# EAGLE design WIRELESS_CHARGING_v1 (EAGLE 9.6.2)
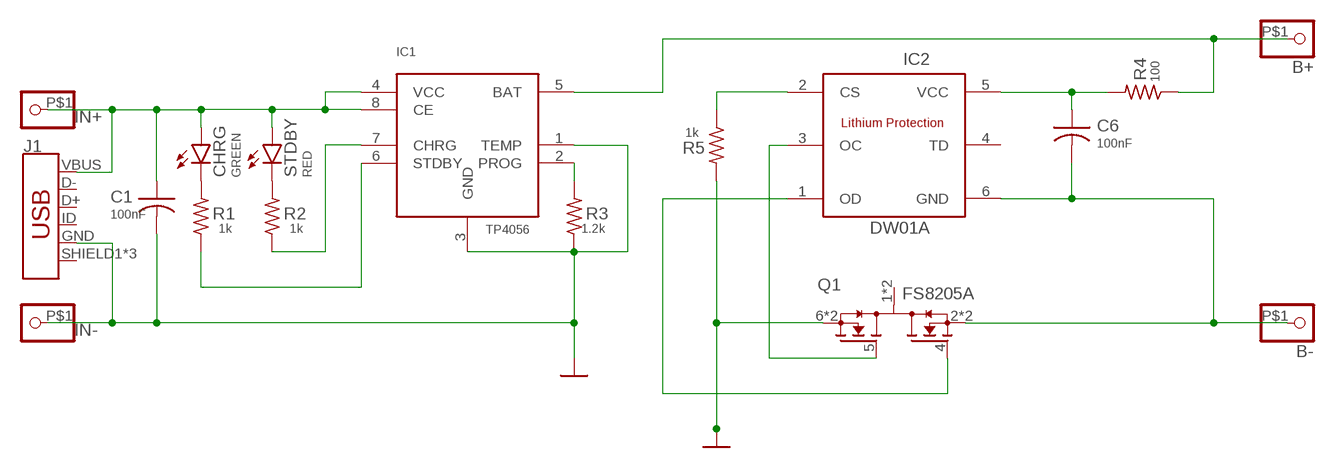
[diagram p0: schematic, sheet 1]

## Parts
B+  PINHD-1X1-BIGPOGO  [1X1-BIGPOGO]
B-  PINHD-1X1-BIGPOGO  [1X1-BIGPOGO]
C1  100nF  C-USC0805  [C0805]
C6  100nF  C-USC0805  [C0805]
CHRG  GREEN  LEDCHIP-LED0805  [CHIP-LED0805]
IC1  TP4056  [SOP-8]
IC2  DW01A  [SOT23-6]
IN+  PINHD-1X1-BIGPOGO  [1X1-BIGPOGO]
IN-  PINHD-1X1-BIGPOGO  [1X1-BIGPOGO]
J1  USB_MICRO-B_FEMALE-SMT  [USB-B-MICRO-SMD]
Q1  FS8205A  [SOP65P640X120-8N]
R1  1k  R-US_M0805  [M0805]
R2  1k  R-US_M0805  [M0805]
R3  1.2k  R-US_M0805  [M0805]
R4  100  R-US_M0805  [M0805]
R5  1k  R-US_M0805  [M0805]
STDBY  RED  LEDCHIP-LED0805  [CHIP-LED0805]

## Nets
GND: C1.2 IC1.1(TEMP) IC1.3(GND) IN-.P$1 J1.GND Q1.6(S2) Q1.7(S2) R3.1 R5.2
N$1: C1.1 CHRG.A IC1.4(VCC) IC1.8(CE) IN+.P$1 J1.VBUS STDBY.A
N$2: IC1.6(STDBY) R1.1
N$3: CHRG.C R1.2
N$4: R2.2 STDBY.C
N$5: IC1.7(CHRG) R2.1
N$6: IC1.2(PROG) R3.2
N$7: C6.1 IC2.5(VCC) R4.2
N$8: B-.P$1 C6.2 IC2.6(GND) Q1.2(S1) Q1.3(S1)
N$9: B+.P$1 IC1.5(BAT) R4.1
N$10: IC2.2(CS) R5.1
N$11: IC2.1(OD) Q1.4(G1)
N$12: IC2.3(OC) Q1.5(G2)
Unconnected: IC2.4(TD) J1.D+ J1.D- J1.ID J1.SHIELD1(SHIELD) J1.SHIELD2(SHIELD) J1.SHIELD3(SHIELD) Q1.1(D12) Q1.8(D12)

## Library data of the parts
B+ B- IN+ IN- = adafruit:PINHD-1X1: Pin header 1x1 for 0.1" spacing With round pins
C1 C6 = rcl:C-US: CAPACITOR, American symbol; SPICEPREFIX: C
CHRG STDBY = led:LED: LED OSRAM: - CHIPLED LG R971, LG N971, LY N971, LG Q971, LY Q971, LO R971, LY R971 LH N974, LH R974 LS Q976, LO Q976, LY Q976 LO Q996 - Hyper CHIPLED LW Q18S LB Q993, LB Q99A, LB R99A - SideLED LS A670, LO A670, LY A670, LG A670, LP A670 LB A673, LV A673, LT A673, LW A673 LH A674 LY A675 LS A676, LA A676, LO A676, LY A676, LW A676 LS A679, LY A679, LG A679 - Hyper Micro SIDELED® LS Y876, LA Y876, LO Y876, LY Y876 LT Y87S - SmartLED LW L88C, LW L88S LB L89C, LB L89S, LG L890 LS L89K, LO L89K, LY L89K LS L896, LA L896, LO L896, LY L896 - TOPLED LS T670, LO T670, LY T670, LG T670, LP T670 LSG T670, LSP T670, LSY T670, LOP T670, LYG T670 LG T671, LOG T671, LSG T671 LB T673, LV T673, LT T673, LW T673 LH T674 LS T676, LA T676, LO T676, LY T676, LB T676, LH T676, LSB T676, LW T676 LB T67C, LV T67C, LT T67C, LS T67K, LO T67K, LY T67K, LW E67C LS E67B, LA E67B, LO E67B, LY E67B, LB E67C, LV E67C, LT E67C LW T67C LS T679, LY T679, LG T679 LS T770, LO T770, LY T770, LG T770, LP T770 LB T773, LV T773, LT T773, LW T773 LH T774 LS E675, LA E675, LY E675, LS T675 LS T776, LA T776, LO T776, LY T776, LB T776 LHGB T686 LT T68C, LB T68C - Hyper Mini TOPLED® LB M676 - Mini TOPLED Santana® LG M470 LS M47K, LO M47K, LY M47K Source: http://www.osram.convergy.de LUXEON: - LUMILED® LXK2-PW12-R00, LXK2-PW12-S00, LXK2-PW14-U00, LXK2-PW14-V00 LXK2-PM12-R00, LXK2-PM12-S00, LXK2-PM14-U00 LXK2-PE12-Q00, LXK2-PE12-R00, LXK2-PE12-S00, LXK2-PE14-T00, LXK2-PE14-U00 LXK2-PB12-K00, LXK2-PB12-L00, LXK2-PB12-M00, LXK2-PB14-N00, LXK2-PB14-P00, LXK2-PB14-Q00 LXK2-PR12-L00, LXK2-PR12-M00, LXK2-PR14-Q00, LXK2-PR14-R00 LXK2-PD12-Q00, LXK2-PD12-R00, LXK2-PD12-S00 LXK2-PH12-R00, LXK2-PH12-S00 LXK2-PL12-P00, LXK2-PL12-Q00, LXK2-PL12-R00 Source: www.luxeon.com KINGBRIGHT: KA-3528ASYC Source: www.kingbright.com
IC1 = TP4056:TP4056; DESCRIPTION: Complete single cell Li-Ion battery with a constant current / constant voltage linear charger; MF: NanJing Top Power ASIC Corp.; MP: TP4056; PACKAGE: Package
IC2 = DW01A:DW01A; DESCRIPTION: One Cell Lithium-ion/Polymer Battery Protection IC; MF: Fortune Semiconductor; MP: DW01A; PACKAGE: Package
J1 = SparkFun-Connectors:USB_MICRO-B: USB Type Micro-B Connector Male/female and PTH/SMT variants SparkFun Products: SparkFun microB USB Breakout <https://www.sparkfun.com/products/12035> SparkFun USB microB Plug Breakout <https://www.sparkfun.com/products/10031> SparkFun ESP8266 Thing <https://www.sparkfun.com/products/13231>; PROD_ID: CONN-11752
Q1 = FS8205A:FS8205A: N/A; MF: Fortune Semiconductor; MP: FS8205A; PACKAGE: Package
R1-R5 = rcl:R-US_: RESISTOR, American symbol; SPICEPREFIX: R

## Board
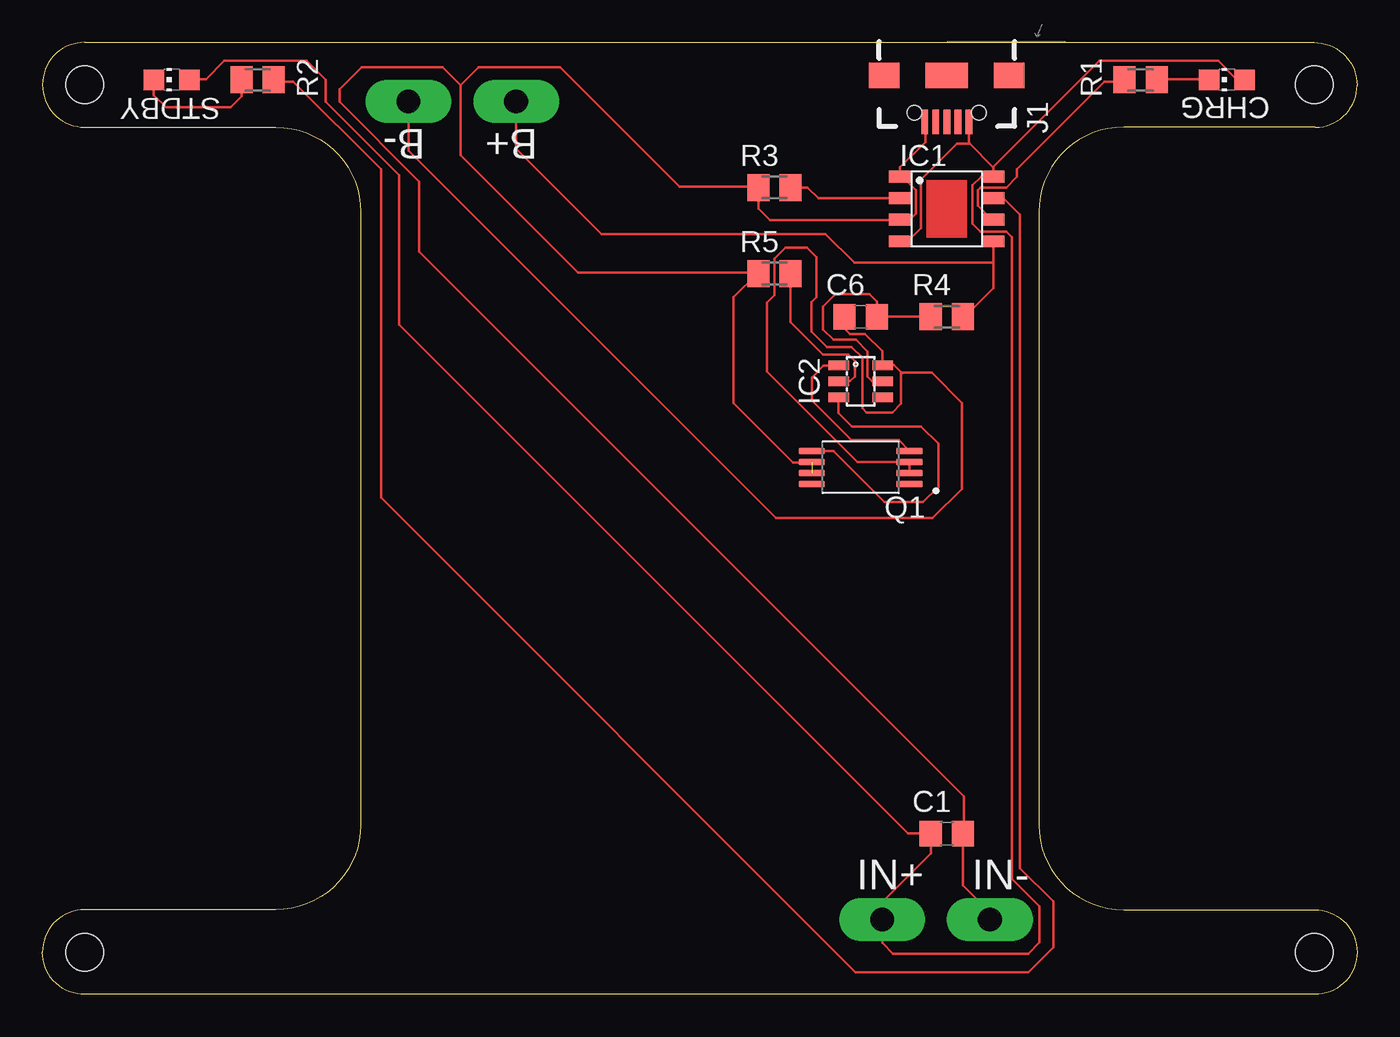
[diagram p1: board, top side]

Size 77.54 x 56.16 mm. Coordinates in mm from the lower left corner, seen from the top.
Outline: 2.5,56.16 75,56.16 arc-90 77.54,53.62 arc-90 75.08,51.16 63.77,51.16 arc90 58.77,46.16 58.77,10 arc90 63.77,5 75.04,5 arc-90 77.54,2.5 arc-90 75.04,0 2.5,0 arc-90 0,2.5 arc-90 2.5,5 13.77,5 arc90 18.77,10 18.77,46.16 arc90 13.77,51.16 2.5,51.16 arc-90 0,53.66 arc-90 2.5,56.16
Copper layers (1*16): Top 0.035mm / dielectric 0.15mm / Bottom 0.035mm
Design rules "default *": minimum track width 6mil, minimum drill 0.35mm, track to track 6mil, track to pad 6mil, pad to pad 6mil, via to via 6mil, smd to smd 6mil, copper to edge 40mil, drill to drill 6mil, minimum pad ring 10mil, minimum via ring 8mil, stop-mask expansion 4mil, vias tented up to drill 0mil, thermal gap 10mil
Holes 2.2 mm at 2.5,53.66 75,53.66 2.5,2.5 75,2.5

### Footprints (pad centres in the part's own frame; a part is rotated, then mirrored left to right if it is on the bottom)
1X1-BIGPOGO = drill 1.4 pad 2.54 long: P$1 0,0
C0805 = smd 1.3 x 1.5: 1 -0.95,0; 2 0.95,0
CHIP-LED0805 = smd 1.2 x 1.2: A 0,-1.05; C 0,1.05
SOP-8 = smd 1.3 x 0.7: 1 -2.75,1.905; 2 -2.75,0.635; 3 -2.75,-0.635; 4 -2.75,-1.905; 5 2.75,-1.905; 6 2.75,-0.635; 7 2.75,0.635; 8 2.75,1.905
SOT23-6 = smd 0.55 x 1.2: 1 -0.95,-1.3; 2 0,-1.3; 3 0.95,-1.3; 4 0.95,1.3; 5 0,1.3; 6 -0.95,1.3
USB-B-MICRO-SMD = smd 1.45 x 0.4: D+ 2.725,0; D- 2.725,0.65; GND 2.725,-1.3; ID 2.725,-0.65; VBUS 2.725,1.3 | smd 1.5 x 1.8: SHIELD1 0,3.685; SHIELD2 0,-3.685 | smd 1.5 x 2.5: SHIELD3 0,0 | hole 0.85: 2.2,1.9; 2.2,-1.9
SOP65P640X120-8N = smd 1.56 x 0.4: 1 -2.88,0.975; 2 -2.88,0.325; 3 -2.88,-0.325; 4 -2.88,-0.975; 5 2.88,-0.975; 6 2.88,-0.325; 7 2.88,0.325; 8 2.88,0.975
M0805 = smd 1.3 x 1.6: 1 -0.95,0; 2 0.95,0

### Placement (x,y rotation side)
B+  27.94,52.68 0 top
B-  21.59,52.68 0 top
C1  53.34,9.5 0 top
C6  48.26,39.98 180 top
CHRG  69.85,53.95 90 top
IC1  53.34,46.33 0 top
IC2  48.26,36.17 270 top
IN+  49.53,4.42 0 top
IN-  55.88,4.42 0 top
J1  53.34,54.2 270 top
Q1  48.26,31.09 180 top
R1  64.77,53.95 0 top
R2  12.7,53.95 180 top
R3  43.18,47.6 0 top
R4  53.34,39.98 180 top
R5  43.18,42.52 180 top
STDBY  7.62,53.95 90 top

### Tracks (layer width: path | path; a pad name or v marks a point on that pad's centre or on a via)
GND  (1 unrouted)
  Top 0.152: J1.GND 52.07,51.45 52.07,50.27 50.59,48.79 IC1.1 50.6,48.36 51.51,47.45 51.51,46.05 51.16,45.69 IC1.3 50.54,45.67 42.93,45.67 42.23,46.37 R3.1 | 55.78,4.47 IN-.P$1 55.88,4.88 54.3,6.45 54.3,9.48 C1.2 54.36,9.57 54.36,11.68 22.23,43.81 22.23,47.96 17.53,52.66 17.53,53.39 18.82,54.69 23.6,54.69 24.66,53.62 | R3.1 42.23,47.14 | R3.1 42.18,47.65 37.57,47.65 30.53,54.69 25.73,54.69 24.66,53.62 | 24.66,53.62 24.66,49.5 31.6,42.57 42.16,42.57 R5.2 42.16,42.52 40.77,41.12 40.77,34.9 44.28,31.38 45.35,31.38 Q1.6
N$1
  Top 0.152: J1.VBUS 54.64,50.24 54.7,50.18 | 54.7,50.18 56.07,48.81 | 56.07,48.81 56.09,48.79 IC1.8 56.08,48.21 55.35,48.21 54.86,47.73 54.86,45.47 55.32,45.01 56.84,45.01 57.17,44.68 57.17,6.83 58.8,5.21 58.8,3.07 58.14,2.41 50.16,2.41 49.53,3.05 IN+.P$1 49.53,5.46 52.39,8.32 C1.1 51.05,9.5 21.03,39.52 21.03,48.34 16.71,52.66 16.71,53.95 15.6,55.07 10.72,55.07 9.65,54 8.69,54 STDBY.A | 56.07,48.81 62.33,55.07 69.34,55.07 70.41,54 70.87,54 CHRG.A | IC1.4 50.6,44.55 51.16,44.55 51.82,45.21 51.82,48.06 53.95,50.19 54.71,50.19 54.7,50.18
N$2
  Top 0.152: IC1.6 56.01,45.69 55.17,46.53 55.17,47.45 55.32,47.6 56.84,47.6 57.48,48.23 57.48,48.69 62.64,53.85 63.7,53.85 R1.1
N$3
  Top 0.152: CHRG.C 68.73,54 65.84,54 R1.2
N$4
  Top 0.152: STDBY.C 6.57,53.04 7.29,52.32 11.1,52.32 11.75,52.97 R2.2
N$5
  Top 0.152: IC1.7 56.69,46.97 57.66,46 57.66,7.44 59.61,5.49 59.61,2.79 58.14,1.32 47.95,1.32 19.96,29.31 19.96,48.67 14.78,53.85 13.72,53.85 R2.1
N$6
  Top 0.152: IC1.2 45.76,46.97 45.13,47.6 R3.2
N$7
  Top 0.152: IC2.5 48.92,36.17 48.66,36.44 48.66,37.93 47.97,38.62 46.65,38.62 46.05,39.22 46.05,40.56 46.79,41.3 48.77,41.3 49.21,40.86 C6.1 R4.2
N$8
  Top 0.152: 46.91,39.98 C6.2 47.31,39.28 47.62,38.96 48.51,38.96 49.53,37.95 49.53,37.15 IC2.6 | 49.65,37.27 IC2.6 | IC2.6 50.23,37.12 50.64,36.71 50.64,36.58 | 50.64,36.58 50.64,34.85 50.13,34.33 48.61,34.33 48.35,34.6 48.35,37.56 47.72,38.19 46.27,38.19 45.36,39.09 45.36,40.84 45.64,41.12 45.64,43.48 45.09,44.04 43.81,44.04 43.18,43.41 43.18,41.25 42.74,40.8 42.74,36.74 48.06,31.41 Q1.3 Q1.2 | 50.64,36.58 50.74,36.68 52.45,36.68 54.23,34.9 54.23,29.82 52.5,28.09 43.26,28.09 21.59,49.76 B-.P$1
N$9
  Top 0.152: 56.08,43.16 56.08,41.66 54.41,39.98 R4.1 | 56.08,43.16 56.08,44.4 IC1.5 | 56.08,43.16 47.88,43.16 46.18,44.86 32.97,44.86 27.94,49.89 B+.P$1
N$10
  Top 0.152: IC2.2 47.62,36.17 47.92,36.46 47.92,37.36 47.53,37.75 46.04,37.75 44.13,39.66 R5.1
N$11
  Top 0.152: IC2.1 46.89,37.08 46.08,37.08 45.39,36.4 45.39,35.03 47.72,32.7 50.51,32.7 Q1.4
N$12
  Top 0.152: Q1.5 46.65,32.06 49.66,29.06 51.94,29.06 52.83,29.95 52.83,32.49 51.82,33.5 47.75,33.5 46.96,34.3 IC2.3

### Text on the board
tPlace: STDBY | CHRG | B+ B- | IN+ IN-